# Altium schematic sheet TRD.SchDoc
size A4; DocumentNumber: 10; SheetNumber: 10; SheetTotal: 10
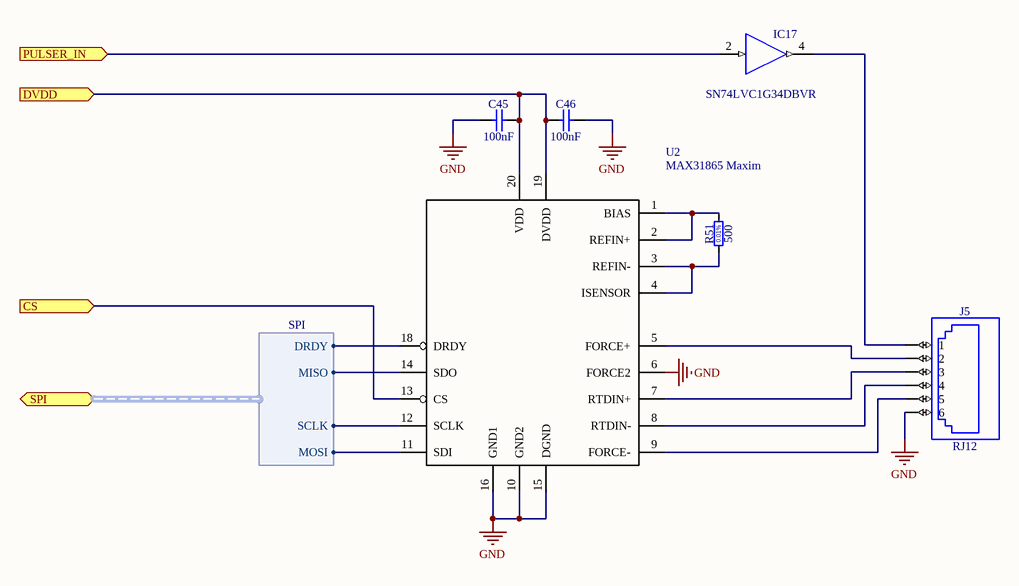
[diagram p0: TRD.SchDoc]

## Parts
C45  100nF  [CAPC3216X140N]
C46  100nF  [CAPC3216X140N]
IC17  SN74LVC1G34DBVR  [SOT95P280X145-5N]
J5  RJ12  [WURTH_615006138521]
R51  500  [RESC2013X64N]
U2  MAX31865 Maxim

## Ports
CS (in), DVDD (in), PULSER_IN (in), SPI (bidir, harness SPI)

## Harnesses
SPI: DRDY, MISO, SCLK, MOSI

## Nets
GND: C45.1 C46.2 IC17.3(GND) J5.6 U2.6(FORCE2) U2.10(GND2) U2.15(DGND) U2.16(GND1)
VDD: IC17.5(VCC)
CS: U2.13(CS) ; port CS
DVDD: C45.2 C46.1 U2.19(DVDD) U2.20(VDD) ; port DVDD
PULSER_IN: IC17.2(IN) ; port PULSER_IN
NetIC17_4: IC17.4(OUT) J5.1
NetJ5_2: J5.2 U2.5(FORCE+)
NetJ5_3: J5.3 U2.7(RTDIN+)
NetJ5_4: J5.4 U2.8(RTDIN-)
NetJ5_5: J5.5 U2.9(FORCE-)
NetR51_1: R51.1 U2.3(REFIN-) U2.4(ISENSOR)
NetR51_2: R51.2 U2.1(BIAS) U2.2(REFIN+)
NetU2_11: U2.11(SDI) ; port SPI.MOSI
NetU2_12: U2.12(SCLK) ; port SPI.SCLK
NetU2_14: U2.14(SDO) ; port SPI.MISO
NetU2_18: U2.18(DRDY) ; port SPI.DRDY

Not connected (* = marked no-connect by the designer): U2 17

## Notes on the sheet
- (in symbol R0805_500R_0.01%_0.2W_0.2PPM_VISHAY_VSMP) 0.01%

## Library data of the parts
C45 C46 = CC1206_100NF_100V_10%_X7R: Non-polarised capacitor; Part Description: SMD Multilayer Chip Ceramic Capacitor; Manufacturer: GENERIC; Manufacturer1 Part Number: 222260115649; Voltage: 100V; TC: X7R; Tolerance: ±10%; Part Number: CC1206_100NF_100V_10%_X7R; Component Kind: Standard; Component Type: Standard; Pin Count: 2; Value: 100nF; Status: Preferred; Manufacturer Part Number: CC1206_100NF_100V_10%_X7R; Case: 1206; Mounted: Yes; Socket: No; SMD: Yes; Sense: No; Manufacturer1 Example: PHYCOMP; Manufacturer1 ComponentHeight: 1.25mm; HelpURL: \\cern.ch\dfs\Applications\Altium\Datasheets\CC1206_X7R_PHYCOMP.pdf; Author: CERN DEM JLC; CreateDate: 24.08.2009; LatestRevisionDate: 24.08.2009
IC17 = SN74LVC1G34DBVR: Single Buffer Gate; Manufacturer: TEXAS INSTRUMENTS; PressFit: No; Bonding: No; Part Number: SN74LVC1G34DBVR; Component Kind: Standard; Component Type: Standard; Device: SN74LVC1G34DBVR; PackageDescription: SOT, 0.95mm pitch; 5 pin, 1.60mm W X 2.90mm L X 1.45mm H body, IPC Medium Density; Part Description: Single Buffer Gate; Manufacturer Part Number: SN74LVC1G34DBVR; Pin Count: 5; Case: SOT23-5; Mounted: Yes; Socket: No; SMD: Yes; Sense: No; ComponentHeight: 1.45mm; Author: CERN DEM JLC; HelpURL: \\cern.ch\dfs\Applications\Altium\Datasheets\SN74LVC1G34DBVR.pdf; CreateDate: 20.01.2014; LatestRevisionDate: 20.01.2014
J5 = WURTH_615006138521: Connector RJ12 (6P6C); Part Description: 1 Port RJ12 Connector, 6P6C,  Straight With Ears; Manufacturer: WURTH ELEKTRONIK; PressFit: No; Part Number: WURTH_615006138521; Component Kind: Standard; Component Type: Standard; Pin Count: 6; Family: RJ12; Mounted: Yes; Socket: No; SMD: No; Sense: No; Status: None; Manufacturer Part Number: 615006138521; ComponentHeight: 16.15mm; HelpURL: \\cern.ch\dfs\Applications\Altium\Datasheets\WURTH_615006138521.pdf; Author: CERN DEM MR; CreateDate: 15.03.2016; LatestRevisionDate: 15.03.2016
R51 = R0805_500R_0.01%_0.2W_0.2PPM_VISHAY_VSMP: Resistor - 0.01%; Part Description: Ultra High Precision Foil Wraparound Surface Mount Chip Resistor; Manufacturer: VISHAY PRECISION; Manufacturer Part Number: Y1624500R000T9R; Power: 0.2W; TC: ±0.2ppm/°C; PressFit: No; Part Number: R0805_500R_0.01%_0.2W_0.2PPM_VISHAY_VSMP; Component Kind: Standard; Component Type: Standard; Pin Count: 2; Value: 500; Status: None; Tolerance: ±0.01%; Case: 0805; Mounted: Yes; Sense: No; Socket: No; SMD: Yes; Manufacturer1 ComponentHeight: 0.64mm; HelpURL: \\cern.ch\dfs\Applications\Altium\Datasheets\R0805_VISHAY_VSMP.pdf; Author: CERN DEM JLC; CreateDate: 22.09.2011; LatestRevisionDate: 22.09.2011
U2 = MAX31865: Name: MAX31865; Manufacturer: Maxim